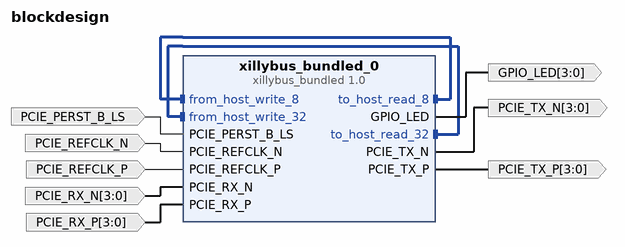
[diagram p0: block diagram of the top level]
# Vivado block design blockdesign, Vivado 2014.1
create_bd_design blockdesign

create_bd_port -dir I PCIE_PERST_B_LS
create_bd_port -dir I PCIE_REFCLK_N
create_bd_port -dir I PCIE_REFCLK_P
create_bd_port -dir I -from 3 -to 0 PCIE_RX_N
create_bd_port -dir I -from 3 -to 0 PCIE_RX_P
create_bd_port -dir O -from 3 -to 0 GPIO_LED
create_bd_port -dir O -from 3 -to 0 PCIE_TX_N
create_bd_port -dir O -from 3 -to 0 PCIE_TX_P

create_bd_cell -type ip -vlnv xillybus.com:user:xillybus_bundled:1.0 xillybus_bundled_0

# ---- connections ----

connect_bd_intf_net [get_bd_intf_pins xillybus_bundled_0/to_host_read_8] [get_bd_intf_pins xillybus_bundled_0/from_host_write_8]
connect_bd_intf_net [get_bd_intf_pins xillybus_bundled_0/to_host_read_32] [get_bd_intf_pins xillybus_bundled_0/from_host_write_32]
connect_bd_net [get_bd_ports PCIE_PERST_B_LS] [get_bd_pins xillybus_bundled_0/PCIE_PERST_B_LS]
connect_bd_net [get_bd_ports PCIE_REFCLK_N] [get_bd_pins xillybus_bundled_0/PCIE_REFCLK_N]
connect_bd_net [get_bd_ports PCIE_REFCLK_P] [get_bd_pins xillybus_bundled_0/PCIE_REFCLK_P]
connect_bd_net [get_bd_ports PCIE_RX_N] [get_bd_pins xillybus_bundled_0/PCIE_RX_N]
connect_bd_net [get_bd_ports PCIE_RX_P] [get_bd_pins xillybus_bundled_0/PCIE_RX_P]
connect_bd_net [get_bd_pins xillybus_bundled_0/GPIO_LED] [get_bd_ports GPIO_LED]
connect_bd_net [get_bd_pins xillybus_bundled_0/PCIE_TX_N] [get_bd_ports PCIE_TX_N]
connect_bd_net [get_bd_pins xillybus_bundled_0/PCIE_TX_P] [get_bd_ports PCIE_TX_P]

validate_bd_design
save_bd_design
